# Altium schematic sheet supply.SchDoc
size A4; SheetNumber: 2; SheetTotal: 8
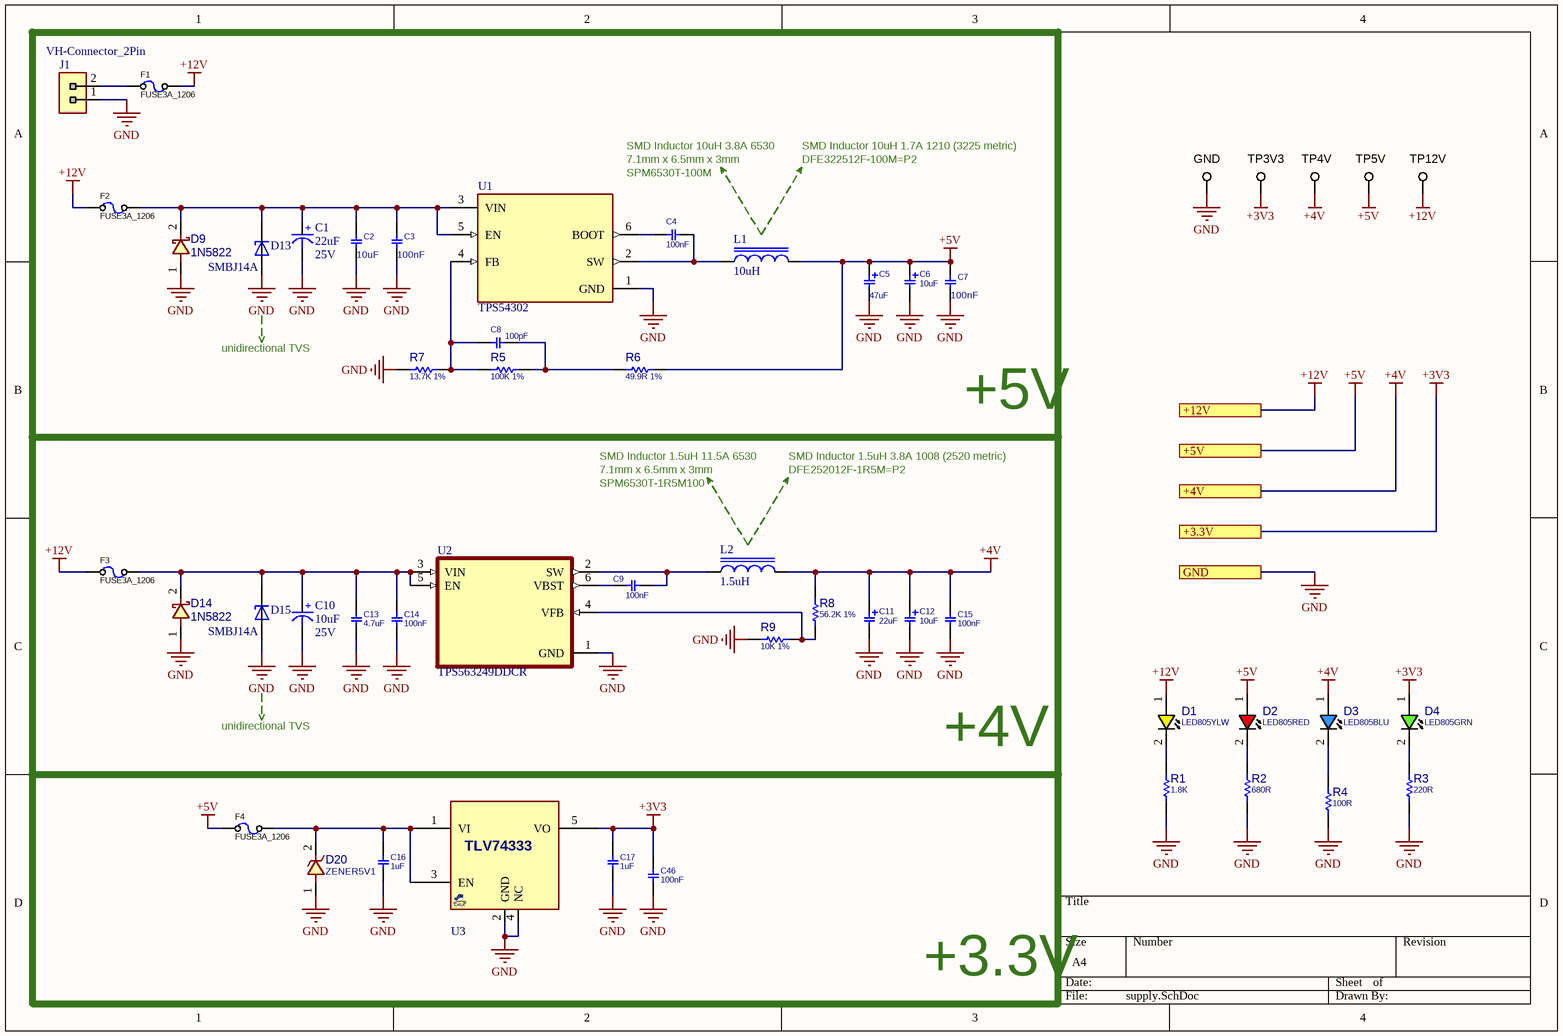
[diagram p0: supply.SchDoc]

## Parts
C1  (no value)  [Capacitor Aluminum 5.0×5.4]
C2  10uF  [C1206]
C3  100nF  [C1206]
C4  100nF  [C0603]
C5  47uF  [C_TN_3528]
C6  10uF  [C_TN_3216]
C7  100nF  [C1206]
C8  100pF  [C0603]
C9  100nF  [C0603]
C10  (no value)  [Capacitor Aluminum 4×5.4]
C11  22uF  [C_TN_3216]
C12  10uF  [C_TN_3216]
C13  4.7uF  [C1206]
C14  100nF  [C1206]
C15  100nF  [C1206]
C16  1uF  [C1206]
C17  1uF  [C1206]
C46  100nF  [C1206]
D1  LED805YLW  [LED0805YLW]
D2  LED805RED  [LED0805RED]
D3  LED805BLU  [LED0805BLU]
D4  LED805GRN  [LED0805GRN]
D9  1N5822  [D_SMA]
D13  SMBJ14A  [SMBJ14A]
D14  1N5822  [D_SMA]
D15  SMBJ14A  [SMBJ14A]
D20  ZENER5V1  [D_SOD123W]
F1  FUSE3A_1206  [F1206]
F2  FUSE3A_1206  [F1206]
F3  FUSE3A_1206  [F1206]
F4  FUSE3A_1206  [F1206]
GND  TESTPOINT_SMD  [TPSMD_S1]  (value not drawn)  (no BOM)
J1  VH-Connector_2Pin  [VH-Connector_2Pin]
L1  10uH  [SMD Inductor 2]
L2  1.5uH  [SMD Inductor 2]
R1  1.8K  [R0805]
R2  680R  [R0805]
R3  220R  [R0805]
R4  100R  [R0805]
R5  100K 1%  [R0603]
R6  49.9R 1%  [R0603]
R7  13.7K 1%  [R0603]
R8  56.2K 1%  [R0603]
R9  10K 1%  [R0603]
TP3V3  TESTPOINT_SMD  [TPSMD_S1]  (value not drawn)  (no BOM)
TP4V  TESTPOINT_SMD  [TPSMD_S1]  (value not drawn)  (no BOM)
TP5V  TESTPOINT_SMD  [TPSMD_S1]  (value not drawn)  (no BOM)
TP12V  TESTPOINT_SMD  [TPSMD_S1]  (value not drawn)  (no BOM)
U1  TPS54302  [TPS54302]
U2  TPS563249DDCR  [TPS563249DDCR]
U3  TLV74333  [SOT23_5]  (value not drawn)

## Ports
+3.3V, +4V, +5V, +12V, GND

## Nets
+3V3: C17.1 C46.1 D4.1(ANODE) TP3V3.1 U3.5(VO) ; port +3.3V
+4V: C11.1 C12.1 C15.1 D3.1(ANODE) L2.2 R8.2 TP4V.1 ; port +4V
+5V: C5.1 C6.1 C7.2 D2.1(ANODE) F4.1 L1.2 R6.2 TP5V.1 ; port +5V
+12V: D1.1(ANODE) F1.2 F2.1 F3.1 TP12V.1 ; port +12V
GND: C1.2(-) C2.1 C3.1 C5.2 C6.2 C7.1 C10.2(-) C11.2 C12.2 C13.2 C14.2 C15.2 C16.2 C17.2 C46.2 D9.1 D13.A D14.1 D15.A D20.1 GND.1 J1.1 R1.2 R2.2 R3.2 R4.2 R7.1 R9.1 U1.1(GND) U2.1(GND) U3.2(GND) U3.4(NC) ; port GND
NetC1_1: C1.1(+) C2.2 C3.2 D9.2 D13.C F2.2 U1.3(VIN) U1.5(EN)
NetC4_1: C4.1 U1.6(BOOT)
NetC4_2: C4.2 L1.1 U1.2(SW)
NetC8_1: C8.1 R5.1 R7.2 U1.4(FB)
NetC8_2: C8.2 R5.2 R6.1
NetC9_1: C9.1 U2.6(VBST)
NetC9_2: C9.2 L2.1 U2.2(SW)
NetC10_1: C10.1(+) C13.1 C14.1 D14.2 D15.C F3.2 U2.3(VIN) U2.5(EN)
NetC16_1: C16.1 D20.2 F4.2 U3.1(VI) U3.3(EN)
NetD1_2: D1.2(CATHODE) R1.1
NetD2_2: D2.2(CATHODE) R2.1
NetD3_2: D3.2(CATHODE) R4.1
NetD4_2: D4.2(CATHODE) R3.1
NetF1_1: F1.1 J1.2
NetR8_1: R8.1 R9.2 U2.4(VFB)

## Notes on the sheet
- (near U1) SPM6530T-100M
- SMD Inductor 10uH 3.8A 6530
- 7.1mm x 6.5mm x 3mm
- DFE322512F-100M=P2
- SMD Inductor 10uH 1.7A 1210 (3225 metric)
- unidirectional TVS
- +5V
- SPM6530T-1R5M100
- SMD Inductor 1.5uH 11.5A 6530
- DFE252012F-1R5M=P2
- SMD Inductor 1.5uH 3.8A 1008 (2520 metric)
- +4V
- +3.3V
- (in symbol Capacitor Aluminum Electrolytic SMD) 10uF; 25V; 22uF

## Library data of the parts
C1 C10 = Capacitor Aluminum Electrolytic SMD
C2 C3 C7 = CAP_SMD_MLCC_1206: CAP, MLCC; PARAM: -, -%; MANF_P#: MANF_PART#; PARAM2: -V; PRICE: 100= 1$; MANF: -; ASSEMBLY: ASSEMBLY
C4 C8 C9 = CAP_SMD_MLCC_0603: CAP, MLCC, -F, -V, MATERIAL, -%, 0201; PARAM: -, -%; MANF_P#: MANF_PART#; PRICE: 100= 1$; MANF: -; PARAM2: -V; ASSEMBLY: ASSEMBLY
  C4 C9: VALUE: 100nF
  C8: VALUE: 100pF
C5 = CAP_SMD_TAN_3528: CAP, SMD, TAN,; PARAM2: -V; VALUE: 47uF
C6 C11 C12 = CAP_SMD_TAN: CAP, SMD, TAN,; PARAM2: -V
  C6 C12: VALUE: 10uF
  C11: VALUE: 22uF
C13-C17 C46 = CAP_SMD_MLCC_1206: CAP, MLCC, -F, -V, MATERIAL, -%, 0201; PARAM: -, -%; MANF_P#: MANF_PART#; PRICE: 100= 1$; MANF: -; PARAM2: -V; ASSEMBLY: ASSEMBLY
  C13: VALUE: 4.7uF
  C14 C15 C46: VALUE: 100nF
  C16 C17: VALUE: 1uF
D1 = LED_SMD_0805_YLW: LED, SMD, 0805, YELLOW; DESC: DESCRIPTION; MANF_P#: MANF_PART#; PARAM2: 2.2V; MANF: MANF; ASSEMBLY: ASSEMBLY; PRICE: 36t@Javan; VALUE: LED805YLW
D2 = LED_SMD_0805_RED: LED, SMD, 0805, RED; DESC: DESCRIPTION; MANF_P#: MANF_PART#; PARAM2: 2.2V; MANF: MANF; ASSEMBLY: ASSEMBLY; PRICE: 36t@Javan; VALUE: LED805RED
D3 = LED_SMD_0805_BLU: LED, SMD, 0805, BLUE; DESC: DESCRIPTION; MANF_P#: MANF_PART#; PARAM2: 2.2V; MANF: MANF; ASSEMBLY: ASSEMBLY; PRICE: 36t@Javan; VALUE: LED805BLU
D4 = LED_SMD_0805_GRN: LED, SMD, 0805, GREEN; PARAM: 20mA; DESC: DESCRIPTION; PARAM2: 2.2V; MANF: -; ASSEMBLY: ASSEMBLY; PRICE: 36t@Javan; MANF_P#: -; VALUE: LED805GRN
D9 D14 = DIODE_SMD_SCHOTTKY_1N5822: DIODE, SCHOTTKY, 40V, 3A; MANF: DIODES; DESC: DESCRIPTION; MANF_P#: 1N5822; ASSEMBLY: ASSEMBLY; PRICE: PRICE; PARAM2: 3A; PARAM: 40V; VALUE: 1N5822
D13 D15 = SMBJ14A: TVS Diode Uni-directional 14V SMB
D20 = DIODE_SMD_ZENER_BZT52HC5V1: DIODE, ZENER, 1W, 5.1V; MANF: Diodes; DESC: DESCRIPTION; PARAM2: 1W, 4Ohm, -55~150oC; MANF_P#: BZT52HC5V1WF-7; ASSEMBLY: ASSEMBLY; PRICE: 0.25$; PARAM: 5.1V; VALUE: ZENER5V1
F1 = FUSE_3A_1206_SLOW: Fuse, 3A, 32VDC, 1206, SMD, Slow Blow; PARAM: 3A; 32VDC; Slow Blow; MANF: Bourns; MANF_P#: SF-1206SP300-2; PARAM2: 0.027Ohm; PRICE: 0.9$; VALUE: FUSE3A_1206
F2-F4 = FUSE_3A_1206_SLOW: Fuse, 3A, 32VDC, 1206, SMD, Slow Blow; PARAM: 2A; 32VDC; Slow Blow; MANF: Bourns; MANF_P#: SF-1206SP300-2; PARAM2: 0.027Ohm; PRICE: 0.9$; VALUE: FUSE3A_1206
GND TP3V3 TP4V TP5V TP12V = TESTPOINT_SMD: TEST POINT; MANF: MANF; MANF_P#: MANF_P#; VALUE: VALUE
L1 L2 = SMD Inductor 2: 7.1mm x 6.5mm x 3mm (6530) part number : SPM6530T-1R5M100
R1-R4 = RES_SMD_0805: RESISTOR, SMD; PARAM: -W; DESC: DESCRIPTION; DIST#: MOUSER; PARAM2: 1%; MANF_P#: -; MANF: -; ASSEMBLY: ASSEMBLY; PRICE: 100= 0.5$
  R1: VALUE: 1.8K
  R2: VALUE: 680R
  R3: VALUE: 220R
  R4: VALUE: 100R
R5-R9 = RES_SMD_0603: RESISTOR, SMD; PARAM: -W; DESC: DESCRIPTION; DIST#: MOUSER; MANF_P#: -; MANF: -; ASSEMBLY: ASSEMBLY; PRICE: 100= 0.5$; PARAM2: 1%
  R5: VALUE: 100K 1%
  R6: VALUE: 49.9R 1%
  R7: VALUE: 13.7K 1%
  R8: VALUE: 56.2K 1%
  R9: VALUE: 10K 1%
U1 = TPS54302: 4.5-V to 28-V Input, 3-A Output, EMI Friendly / Synchronous Step-Down Converter
U2 = TPS563249DDCR: 17-V, 3-A, constant 1.4-MHz synchronous step-down voltage regulator
U3 = VREG_TLV74333_SOT23: REG, Linear, LDO0.12V, Fixed, 300mA, VIN1.4~5.5V, VOUT1~5.5V, SOT-23-5; MANF: Texas Instruments; MANF_P#: TLV74333PDQN; PARAM2: 1.4~5.5Vin, LDO0.12V, Fixed3.0V; PARAM: 300mA, 50dB PSRR, -40~125°C; PRICE: $0.3; VALUE: TLV74333